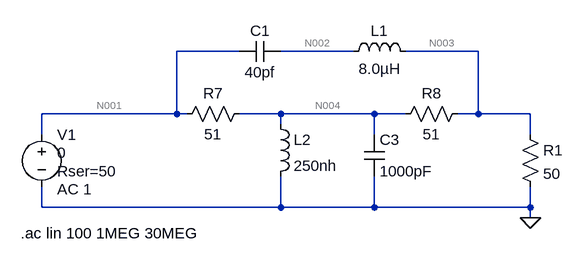
[diagram p0: schematic Diplexer_9MHz.asc]
Diplexer_9MHz.asc, the LTspice schematic file:
Version 4
SHEET 1 880 680
WIRE -64 96 -160 96
WIRE 112 96 0 96
WIRE 304 96 192 96
WIRE -160 192 -160 96
WIRE -160 192 -368 192
WIRE -144 192 -160 192
WIRE 0 192 -64 192
WIRE 144 192 0 192
WIRE 192 192 144 192
WIRE 304 192 304 96
WIRE 304 192 272 192
WIRE 384 192 304 192
WIRE 0 208 0 192
WIRE -368 224 -368 192
WIRE 144 224 144 192
WIRE 384 224 384 192
WIRE -368 336 -368 304
WIRE 0 336 0 288
WIRE 0 336 -368 336
WIRE 144 336 144 288
WIRE 144 336 0 336
WIRE 384 336 384 304
WIRE 384 336 144 336
WIRE 384 352 384 336
FLAG 384 352 0
SYMBOL cap 128 224 R0
SYMATTR InstName C3
SYMATTR Value 1000pF
SYMBOL cap 0 80 R90
WINDOW 0 0 32 VBottom 2
WINDOW 3 32 32 VTop 2
SYMATTR InstName C1
SYMATTR Value 40pf
SYMBOL res -48 176 R90
WINDOW 0 0 56 VBottom 2
WINDOW 3 32 56 VTop 2
SYMATTR InstName R7
SYMATTR Value 51
SYMBOL res 288 176 R90
WINDOW 0 0 56 VBottom 2
WINDOW 3 32 56 VTop 2
SYMATTR InstName R8
SYMATTR Value 51
SYMBOL ind 96 112 R270
WINDOW 0 32 56 VTop 2
WINDOW 3 5 56 VBottom 2
SYMATTR InstName L1
SYMATTR Value 8.0µH
SYMBOL ind -16 192 R0
SYMATTR InstName L2
SYMATTR Value 250nh
SYMBOL res 368 208 R0
SYMATTR InstName R1
SYMATTR Value 50
SYMBOL voltage -368 208 R0
WINDOW 3 24 44 Left 2
WINDOW 123 24 100 Left 2
WINDOW 39 24 72 Left 2
SYMATTR Value 0
SYMATTR Value2 AC 1
SYMATTR SpiceLine Rser=50
SYMATTR InstName V1
TEXT -400 376 Left 2 !.ac lin 100 1MEG 30MEG

The netlist it stands for:
* Diplexer_9MHz.asc
C3 N004 0 1000pF
C1 N002 N001 40pf
R7 N004 N001 51
R8 N003 N004 51
L1 N002 N003 8.0µH
L2 N004 0 250nh
R1 N003 0 50
V1 N001 0 0 AC 1 Rser=50
.ac lin 100 1MEG 30MEG
.backanno
.end

* Results of the author's LTspice run, read from the files saved beside the schematic
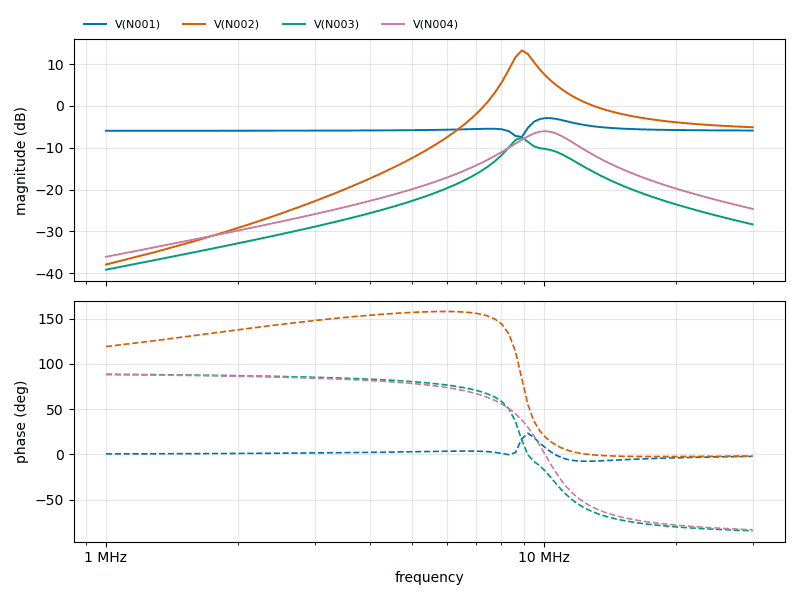
[diagram p1: AC Analysis of Diplexer_9MHz.asc, plotted from the saved traces]
* AC Analysis, 1 run:
*   V(N001): -5.93 dB at 1 MHz, -5.88 dB at 30 MHz, peak -2.90 dB at 10.08 MHz, 3 dB below the peak at 9.106 MHz
*   V(N002): -37.93 dB at 1 MHz, -5.08 dB at 30 MHz, peak 13.29 dB at 8.909 MHz, 3 dB below the peak at 8.478 MHz and 9.533 MHz
*   V(N003): -39.16 dB at 1 MHz, -28.33 dB at 30 MHz, peak -7.50 dB at 8.909 MHz, 3 dB below the peak at 8.22 MHz and 10.34 MHz
*   V(N004): -36.08 dB at 1 MHz, -24.62 dB at 30 MHz, peak -6.02 dB at 10.08 MHz, 3 dB below the peak at 8.612 MHz and 11.76 MHz